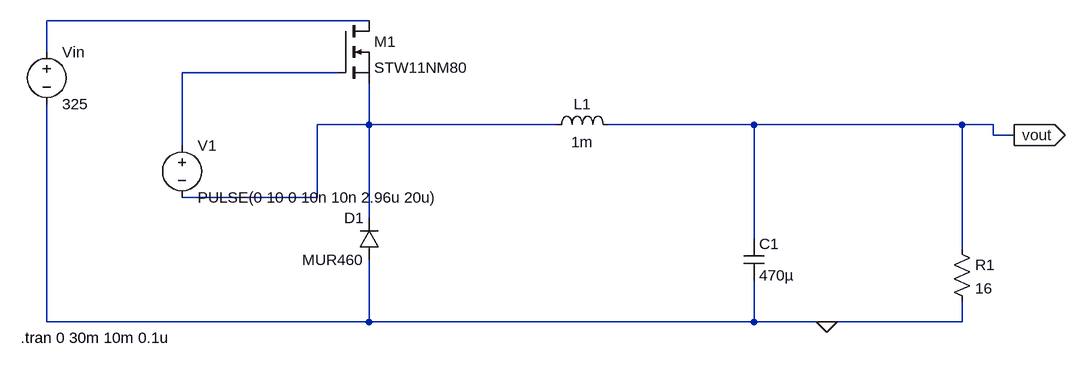
[diagram p0: schematic buck converter.asc]
buck converter.asc, the LTspice schematic file:
Version 4
SHEET 1 1664 680
WIRE 560 64 64 64
WIRE 64 112 64 64
WIRE 512 144 272 144
WIRE 560 224 560 160
WIRE 560 224 480 224
WIRE 848 224 560 224
WIRE 1152 224 928 224
WIRE 1472 224 1152 224
WIRE 1520 224 1472 224
WIRE 1520 240 1520 224
WIRE 1552 240 1520 240
WIRE 272 256 272 144
WIRE 480 336 480 224
WIRE 480 336 272 336
WIRE 560 368 560 224
WIRE 1152 400 1152 224
WIRE 1472 416 1472 224
WIRE 64 528 64 192
WIRE 560 528 560 432
WIRE 560 528 64 528
WIRE 1152 528 1152 464
WIRE 1152 528 560 528
WIRE 1264 528 1152 528
WIRE 1472 528 1472 496
WIRE 1472 528 1264 528
FLAG 1264 528 0
FLAG 1552 240 vout
IOPIN 1552 240 Out
SYMBOL voltage 64 96 R0
WINDOW 123 0 0 Left 0
WINDOW 39 0 0 Left 0
SYMATTR InstName Vin
SYMATTR Value 325
SYMBOL nmos 512 64 R0
SYMATTR InstName M1
SYMATTR Value STW11NM80
SYMBOL ind 832 240 R270
WINDOW 0 32 56 VTop 2
WINDOW 3 5 56 VBottom 2
SYMATTR InstName L1
SYMATTR Value 1m
SYMBOL cap 1136 400 R0
SYMATTR InstName C1
SYMATTR Value 470µ
SYMBOL res 1456 400 R0
SYMATTR InstName R1
SYMATTR Value 16
SYMBOL diode 576 432 R180
WINDOW 0 24 64 Left 2
WINDOW 3 24 0 Left 2
SYMATTR InstName D1
SYMATTR Value MUR460
SYMBOL voltage 272 240 R0
WINDOW 123 0 0 Left 0
WINDOW 39 0 0 Left 0
SYMATTR InstName V1
SYMATTR Value PULSE(0 10 0 10n 10n 2.96u 20u)
TEXT 24 552 Left 2 !.tran 0 30m 10m 0.1u

The netlist it stands for:
* buck converter.asc
Vin N001 0 325
M1 N001 N002 N003 N003 STW11NM80
L1 N003 vout 1m
C1 vout 0 470µ
R1 vout 0 16
D1 0 N003 MUR460
V1 N002 N003 PULSE(0 10 0 10n 10n 2.96u 20u)
.model D D
.lib standard.dio
.model NMOS NMOS
.model PMOS PMOS
.lib standard.mos
.tran 0 30m 10m 0.1u
.backanno
.end